# Altium schematic sheet Schematic.SchDoc: Genusan Watt Meter
size OrCAD A; Date: 10-11-'18; CheckedBy: N. Leijen; Organization: Solar Boat Twente; Address1: Marssteden 124; Address2: 7547 TD, Enschede; Address3: Overijssel; Address4: The Netherlands; Revision: 1.7; Author1: S.W.S. Oosterveld; Author2: F.H.B. Somhorst
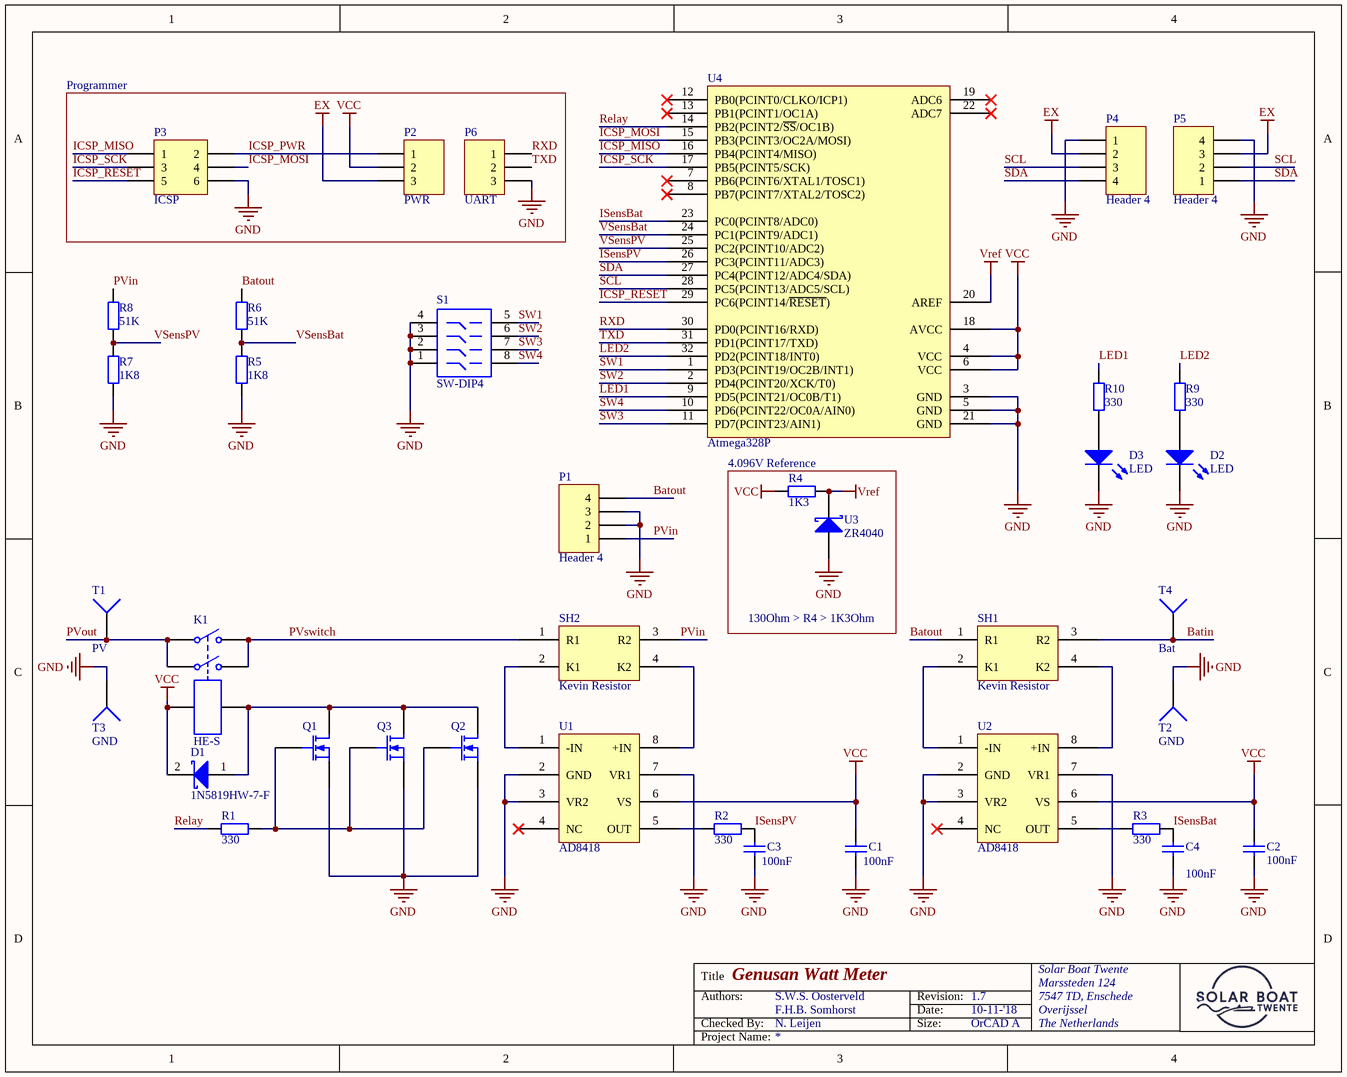
[diagram p0: Schematic.SchDoc]

## Parts
C1  value 100nF  [CAP 0805/2012]  (hidden comment: Cap)
C2  value 100nF  [CAP 0805/2012]  (hidden comment: Cap)
C3  value 100nF  [CAP 0805/2012]  (hidden comment: Cap)
C4  value 100nF  [CAP 0805/2012]  (hidden comment: Cap)
D1  1N5819HW-7-F  [DIOD-SOD-123-2_V]
D2  LED  [LED 0805/2012 RED]
D3  LED  [LED 0805/2012 RED]
K1  HE-S  [Relay HE-S Parasonic]
P1  Header 4  [4Pin 6.35mm Connector]
P2  PWR  [HDR1X3]
P3  ICSP  [HDR2X3]
P4  Header 4  [TE 282834-4]
P5  Header 4  [TE 282834-4]
P6  UART  [HDR1X3H]
Q1  MOSFET-N  [DIODES SOT-23-3]  (value not drawn)
Q2  MOSFET-N  [DIODES SOT-23-3]  (value not drawn)
Q3  MOSFET-N  [DIODES SOT-23-3]  (value not drawn)
R1  value 330  [RES 0805/2012]  (hidden comment: Res2)
R2  value 330  [RES 0805/2012]  (hidden comment: Res2)
R3  value 330  [RES 0805/2012]  (hidden comment: Res2)
R4  value 1K3  [RES 0805/2012]  (hidden comment: Res2)
R5  value 1K8  [RES 0805/2012]  (hidden comment: Res2)
R6  value 51K  [RES 0805/2012]  (hidden comment: Res2)
R7  value 1K8  [RES 0805/2012]  (hidden comment: Res2)
R8  value 51K  [RES 0805/2012]  (hidden comment: Res2)
R9  value 330  [RES 0805/2012]  (hidden comment: Res2)
R10  value 330  [RES 0805/2012]  (hidden comment: Res2)
S1  SW-DIP4  [DIP-8]
SH1  Kevin Resistor  [TE TLR Shunt]
SH2  Kevin Resistor  [TE TLR Shunt]
T1  PV  [PCB_Pin_Outsteeksel]
T2  GND  [PCB_Pin_Outsteeksel]
T3  GND  [PCB_Pin_Outsteeksel]
T4  Bat  [PCB_Pin_Outsteeksel]
U1  AD8418  [INTERSIL MSOP-8 M8.118]
U2  AD8418  [INTERSIL MSOP-8 M8.118]
U3  ZR4040  [DIODES SOT-23-3]
U4  Atmega328P  [ST LQFP-32 7X7MM]

## Blocks framed on the sheet
Programmer: P2 P3 P6

## Nets
EX: P2.3 P4.2 P5.3
GND: C1.1 C2.2 C3.1 C4.1 D2.2(K) D3.2(K) P1.2 P1.3 P3.6 P4.1 P5.4 P6.3 Q1.2(S) Q2.2(S) Q3.2(S) R5.1 R7.1 S1.1 S1.2 S1.3 S1.4 T2.1 T3.1 U1.2(GND) U1.3(VR2) U1.7(VR1) U2.2(GND) U2.3(VR2) U2.7(VR1) U3.3(A) U4.3(GND) U4.5(GND) U4.21(GND)
VCC: C1.2 C2.1 D1.2(K) K1.5 P2.2 R4.2 U1.6(VS) U2.6(VS) U4.4(VCC) U4.6(VCC) U4.18(AVCC)
Vref: R4.1 U3.1(K) U4.20(AREF)
Batin: SH1.3(R2) T4.1
Batout: P1.4 R6.2 SH1.1(R1)
ICSP_MISO: P3.1 U4.16(PB4(PCINT4/MISO))
ICSP_MOSI: P3.4 U4.15(PB3(PCINT3/OC2A/MOSI))
ICSP_PWR: P2.1 P3.2
ICSP_RESET: P3.5 U4.29(PC6(PCINT14/~{RESET}))
ICSP_SCK: P3.3 U4.17(PB5(PCINT5/SCK))
ISensBat: C4.2 R3.1 U4.23(PC0(PCINT8/ADC0))
ISensPV: C3.2 R2.1 U4.26(PC3(PCINT11/ADC3))
LED1: R10.2 U4.9(PD5(PCINT21/OC0B/T1))
LED2: R9.2 U4.32(PD2(PCINT18/INT0))
PVin: P1.1 R8.2 SH2.3(R2)
PVout: K1.1 K1.3 T1.1
PVswitch: K1.2 K1.4 SH2.1(R1)
Relay: R1.2 U4.14(PB2(PCINT2/~{SS}/OC1B))
RXD: P6.1 U4.30(PD0(PCINT16/RXD))
SCL: P4.3 P5.2 U4.28(PC5(PCINT13/ADC5/SCL))
SDA: P4.4 P5.1 U4.27(PC4(PCINT12/ADC4/SDA))
SW1: S1.5 U4.1(PD3(PCINT19/OC2B/INT1))
SW2: S1.6 U4.2(PD4(PCINT20/XCK/T0))
SW3: S1.7 U4.11(PD7(PCINT23/AIN1))
SW4: S1.8 U4.10(PD6(PCINT22/OC0A/AIN0))
TXD: P6.2 U4.31(PD1(PCINT17/TXD))
VSensBat: R5.2 R6.1 U4.24(PC1(PCINT9/ADC1))
VSensPV: R7.2 R8.1 U4.25(PC2(PCINT10/ADC2))
NetD1_1: D1.1(A) K1.6 Q1.1(D) Q2.1(D) Q3.1(D)
NetD2_1: D2.1(A) R9.1
NetD3_1: D3.1(A) R10.1
NetQ1_3: Q1.3(G) Q2.3(G) Q3.3(G) R1.1
NetR2_2: R2.2 U1.5(OUT)
NetR3_2: R3.2 U2.5(OUT)
NetSH1_2: SH1.2(K1) U2.1(-IN)
NetSH1_4: SH1.4(K2) U2.8(+IN)
NetSH2_2: SH2.2(K1) U1.1(-IN)
NetSH2_4: SH2.4(K2) U1.8(+IN)

Not connected (* = marked no-connect by the designer): U1 4(NC)*; U2 4(NC)*; U4 7(PB6(PCINT6/XTAL1/TOSC1))* 8(PB7(PCINT7/XTAL2/TOSC2))* 12(PB0(PCINT0/CLKO/ICP1))* 13(PB1(PCINT1/OC1A))* 19(ADC6)* 22(ADC7)*

## Notes on the sheet
- 4.096V Reference
- 130Ohm > R4 > 1K3Ohm
- Title
- Authors:
- Checked By:
- Revision:
- Date:
- Size:
- OrCAD A
- Project Name:

## Library data of the parts
C1-C4 = Cap: Capacitor; Published: 8-Jun-2000; LatestRevisionDate: 17-Jul-2002; LatestRevisionNote: Re-released for DXP Platform.; PackageReference: RAD-0.3; Publisher: Altium Limited; PackageDescription: Radial Cap, Thru-Hole; 2 Leads; 0.3 in Pin Spacing
D1 = CMP-0303-00003-1: 1.0 A Surface Mount Schottky Barrier Rectifier, 40 V, -65 to 125 degC, 2-Pin SOD-123 Package, RoHS, Tape and Reel; Manufacturer: Diodes Inc; @ VR (V): 40; @ Terminal Temperature TT (degC): 90; Maximum Average Rectified Current IO (A): 1; Total Capacitance CT (pF): 50; Peak Forward Surge Current IFSM (A): 25; Forward Voltage Drop VF (V): 0.45; VR (RMS) (V): 28; DatasheetVersion: Rev. 15-2; PackageReference: SOD-123-2; PackageDescription: 2-Pin SOD-123, Body 2.7 x 1.55 mm, Pitch 3.7 mm; ComponentLink1Description: Manufacturer URL; ComponentLink1URL: http://www.diodes.com/; ComponentLink2Description: Datasheet; ComponentLink2URL: http://www.diodes.com/datasheets/ds30217.pdf; RoHS: TRUE; PartNumber: 1N5819HW-7-F; @ IF (A): 1; Operating and Storage Temperature Range: -65 to 125 degC; Mounting Technology: Surface Mount; Maximum Reverse Current IR (uA): 50; Peak Repetitive Reverse Voltage VRRM (V): 40; Packing: Tape and Reel
D2 D3 = LED0: Typical INFRARED GaAs LED; Published: 8-Jun-2000; LatestRevisionDate: 08-Jul-2005; LatestRevisionNote: Mech Layer 1 removed.; PackageReference: LED-0; Publisher: Altium Limited; PackageDescription: LED; 2 Leads
K1 = Relay-DPST: Dual-Pole Single-Throw Relay; pin to pad: 2>7 3>2 4>8 5>4 6>5; Published: 24-Mar-1999; LatestRevisionDate: 17-Jul-2002; LatestRevisionNote: Re-released for DXP Platform.; PackageReference: MODULE6; Publisher: Altium Limited
P1 P4 P5 = Header 4: Header, 4-Pin; LatestRevisionDate: 17-Jul-2002; LatestRevisionNote: Re-released for DXP Platform.; Publisher: Altium Limited
P2 P6 = Header 3: Header, 3-Pin; LatestRevisionDate: 17-Jul-2002; LatestRevisionNote: Re-released for DXP Platform.; Publisher: Altium Limited
P3 = Header 3X2: Header, 3-Pin, Dual row; LatestRevisionDate: 17-Jul-2002; LatestRevisionNote: Re-released for DXP Platform.; Publisher: Altium Limited
Q1-Q3 = MOSFET-N: N-Channel MOSFET; pin to pad: 1>2 2>3 3>1; Published: 8-Jun-2000; LatestRevisionDate: 17-Jul-2002; LatestRevisionNote: Re-released for DXP Platform.; PackageVersion: 1995/1996; PackageReference: E3; Publisher: Altium Limited; PackageDescription: TO, Flat Index; 3 In-Line, Axial Leads; Body Dia. 4.6mm; Lead Dia. 0.5 mm (max)
R1-R10 = Res2: Resistor; Published: 8-Jun-2000; LatestRevisionDate: 17-Jul-2002; LatestRevisionNote: Re-released for DXP Platform.; PackageReference: AXIAL-0.4; Publisher: Altium Limited; PackageDescription: Axial Device, Thru-Hole; 2 Leads; 0.4 in Pin Spacing
S1 = SW-DIP4: DIP Switch; Published: 24-Mar-1999; LatestRevisionDate: 17-Jul-2002; LatestRevisionNote: Re-released for DXP Platform.; PackageReference: DIP-8; Publisher: Altium Limited
T1-T4 = Socket: LatestRevisionDate: 17-Jul-2002; LatestRevisionNote: Re-released for DXP Platform.; Publisher: Altium Limited
U3 = Diode 10TQ035: Schottky Rectifier; Note: Terminal 2 is the TAB and is electrically connected to the cathode; Published: 8-Jun-2000; LatestRevisionDate: 17-Jul-2002; LatestRevisionNote: Re-released for DXP Platform.; DatasheetVersion: PD-2.057B; PackageVersion: Feb-1998; PackageReference: TO-220AC; Publisher: Altium Limited; PackageDescription: TO, Thru-Hole, Vertical, Heatsink Mounted; 3 In-Line Leads (1 Absent); Pitch 2.54 mm; ComponentLink1Description: Manufacturer Link; ComponentLink1URL: http://www.irf.com/; ComponentLink2Description: Datasheet; ComponentLink2URL: http://www.irf.com/product-info/datasheets/data/10tq.pdf